# Altium schematic sheet robotShield_OLED.SchDoc
size A4; SheetNumber: 6; SheetTotal: 6
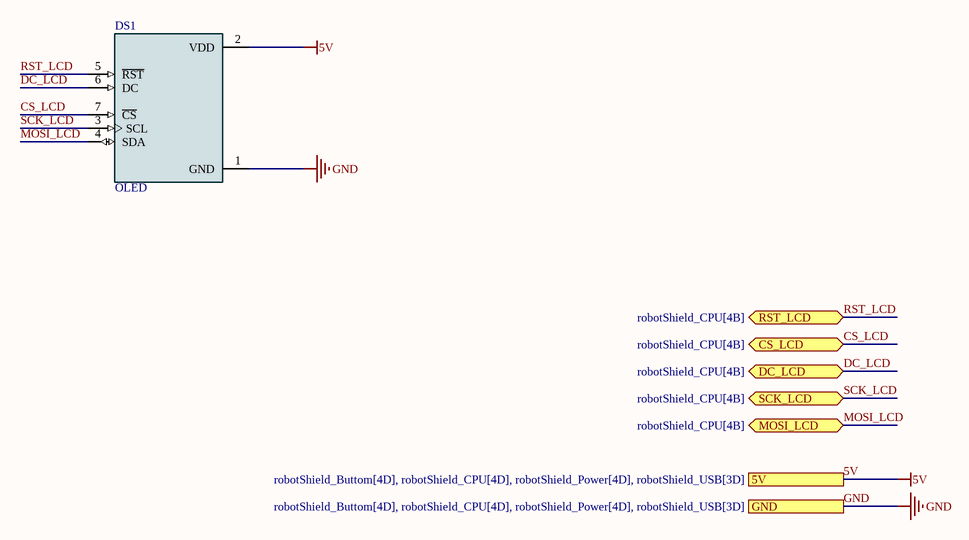
[diagram p0: robotShield_OLED.SchDoc]

## Parts
DS1  OLED  [OLD_SPI_1.3]

## Ports
5V (see robotShield_Buttom[4D], robotShield_CPU[4D], robotShield_Power[4D], robotShield_USB[3D]), CS_LCD (bidir, see robotShield_CPU[4B]), DC_LCD (bidir, see robotShield_CPU[4B]), GND (see robotShield_Buttom[4D], robotShield_CPU[4D], robotShield_Power[4D], robotShield_USB[3D]), MOSI_LCD (bidir, see robotShield_CPU[4B]), RST_LCD (bidir, see robotShield_CPU[4B]), SCK_LCD (bidir, see robotShield_CPU[4B])

## Nets
5V: DS1.2(VDD) ; port 5V
GND: DS1.1(GND) ; port GND
CS_LCD: DS1.7(~{CS}) ; port CS_LCD
DC_LCD: DS1.6(DC) ; port DC_LCD
MOSI_LCD: DS1.4(SDA) ; port MOSI_LCD
RST_LCD: DS1.5(~{RST}) ; port RST_LCD
SCK_LCD: DS1.3(SCL) ; port SCK_LCD

## Library data of the parts
DS1 = OLED: Non-Touch Graphic LCD Display Module - Blue OLED SPI 1.3 (33.02mm) 128 x 64; MF: Orient Display; MP: AOM12864A0-1.3BW-ANO; SnapEDA_Link: https://www.snapeda.com/parts/AOM12864A0-1.3BW-ANO/Orient+Display/view-part/?ref=snap; Package: None; Value: *; Check_prices: https://www.snapeda.com/parts/AOM12864A0-1.3BW-ANO/Orient+Display/view-part/?ref=eda